# Altium schematic sheet battery_charger.SchDoc
size 297 x 209 mm; Address1: Address1; Address2: Address2; Address3: Address3; Address4: Address4; SheetNumber: 1; Scale: 1:1; Обозначение документа: АБВГ.123456.001Э3
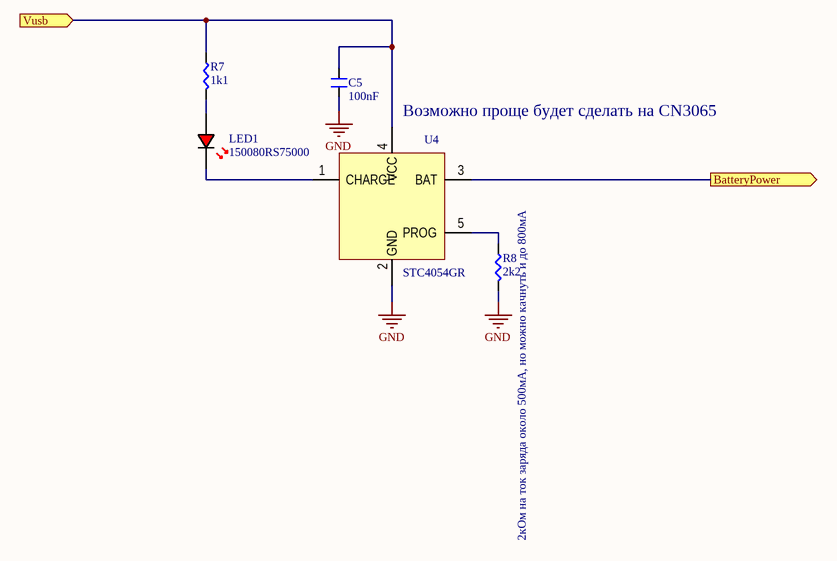
[diagram p0: battery_charger.SchDoc]

## Parts
C5  100nF  [CAP0603]
LED1  150080RS75000  [LED0805]
R7  1k1  [RES0603]
R8  2k2  [RES0603]
U4  STC4054GR  [SOT-23-5]

## Ports
BatteryPower (out), Vusb (in)

## Nets
GND: C5.1 R8.1 U4.2(GND)
BatteryPower: U4.3(BAT) ; port BatteryPower
Vusb: C5.2 R7.2 U4.4(VCC) ; port Vusb
NetLED1_A: LED1.A R7.1
NetLED1_C: LED1.C U4.1(CHARGE)
NetR8_2: R8.2 U4.5(PROG)

## Notes on the sheet
- (near U4) Возможно проще будет сделать на CN3065
- (near R8) 2кОм на ток заряда около 500мА, но можно качнуть и до 800мА
- Подп. и дата
- Инв. № дубл.
- Взам. инв. №
- Инв. № подл.
- Изм.
- Лист
- № докум.
- Подп.
- Дата
- Копировал
- Формат А4

## Library data of the parts
C5 = GCM188R71H104KA57J: Tolerance ±10% / Rated Voltage 50Vdc / Temperature 0±30ppm/℃; Manufacturer: Arrow Electronics; Item: 100nF 50V  ±10%; Vdc: 50V; Part Number: GCM188R71H104KA57J; Supplier 1: Mouser; Supplier Part Number 1: 81-GCM188R71H104KA7J; Case: 0603; Tolerance: 10%; Value: 100nF; HelpURL: http://www.farnell.com/datasheets/4360.pdf?src-supplier=Element14; Category: Multilayer Ceramic Capacitors - SMD/SMT
LED1 = 150080RS75000: Standard LEDs - SMD WL-SMCW SMDMono TpVw Waterclr 0805 Red; Manufacturer: Wurth Elektronik; Imax: 20 mA; Value: 2V; Part Number: 150080RS75000; Item: 150080RS75000; Supplier 1: Mouser; Supplier Part Number 1: 710-150080RS75000; Color: Red; Case: 0805; HelpURL: https://eu.mouser.com/datasheet/2/445/150080VS75000-3085206.pdf; Category: Standard LEDs - SMD
R7 = ERJ-3EKF1101V: Tolerance ±1% / Power (Watts) 0.1W, 1/10W / Temperature Coefficient ±100ppm/°C; Manufacturer: Panasonic; Item: 1k1  ±1% 0.1W; Part Number: ERJ-3EKF1101V; Supplier 1: Mouser; Supplier Part Number 1: 667-ERJ-3EKF1101V; Case: 0603; Tolerance: 1%; Value: 1k1; HelpURL: https://eu.mouser.com/datasheet/2/315/AOA0000C304-1149620.pdf; Category: Thin Film Resistors - SMD
R8 = 541-2.20KHCT-ND: Tolerance ±1% / Power (Watts) 0.1W, 1/10W / Temperature Coefficient ±100ppm/°C; Manufacturer: Vishay Dale; Item: 2k2 ±1% 0.1W; Part Number: 541-2.20KHCT-ND; Supplier 1: Digi-Key; Case: 0603; Tolerance: 1%; Value: 2k2; HelpURL: http://www.farnell.com/datasheets/2111203.pdf?src-supplier=Element14; Category: Thin Film Resistors - SMD
U4 = STC4054GR: 800mA Standalone linear Li-Ion / Battery charger with thermal regulation; Manufacturer: STMicroelectronics; Part Number: STC4054GR; Item: STC4054GR; Supplier 1: ChipDip; Supplier Part Number 1: 9000208263; Case: TSOT-23-5; HelpURL: https://static.chipdip.ru/lib/264/DOC029264196.pdf; Category: Battery Management